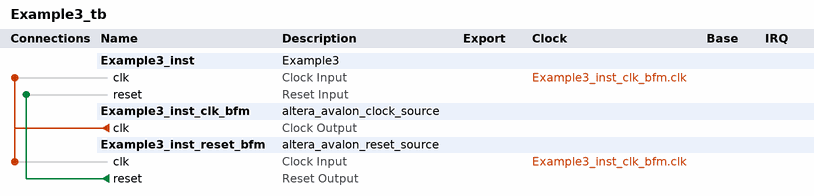
[diagram p0: system contents]
# Platform Designer (Qsys) system Example3_tb, Cyclone V 5CGXFC7C7F23C8
# Parameters at their usual value, and those the tool derives, are not listed.
package require -exact qsys 21.1
create_system Example3_tb
set_project_property DEVICE_FAMILY {Cyclone V}
set_project_property DEVICE 5CGXFC7C7F23C8

add_instance Example3_inst Example3 1.0

add_instance Example3_inst_clk_bfm altera_avalon_clock_source 21.1

add_instance Example3_inst_reset_bfm altera_avalon_reset_source 21.1
set_instance_parameter_value Example3_inst_reset_bfm ASSERT_HIGH_RESET 0
set_instance_parameter_value Example3_inst_reset_bfm INITIAL_RESET_CYCLES 50

# connections
add_connection Example3_inst_clk_bfm.clk Example3_inst.clk clock
add_connection Example3_inst_clk_bfm.clk Example3_inst_reset_bfm.clk clock
add_connection Example3_inst_reset_bfm.reset Example3_inst.reset reset

set_interconnect_requirement {$system} qsys_mm.clockCrossingAdapter HANDSHAKE
set_interconnect_requirement {$system} qsys_mm.enableEccProtection FALSE
set_interconnect_requirement {$system} qsys_mm.insertDefaultSlave FALSE
set_interconnect_requirement {$system} qsys_mm.maxAdditionalLatency 1

save_system Example3_tb.qsys
